# Altium schematic sheet SDEC944-xD_Chargeur_Batterie.SchDoc: Chargeur Batterie
size 393 x 270 mm; CompanyName: Seccom; Address1: 521, rue du capt. François Garbit; Address2: 69440 Mornant; Address3: seccom@seccom.fr; Address4: www.seccom.fr; DocumentNumber: 4; SheetNumber: 4; SheetTotal: 22; PageSetup: Record=PageOptions|CenterHorizontal=True|CenterVertical=True|PrintScale=0.72|XCorrection=1.00|YCorrection=1.00|PrintKind=0|BorderSize=5000000|LeftOffset=0|BottomOffset=0|Orientation=2|PaperLength=1000|PaperWidth=1000|Scale=100|PaperSource=7|PrintQuality=-4|MediaType=1|DitherType=10|PaperKind=A4|PrintScaleMode=1
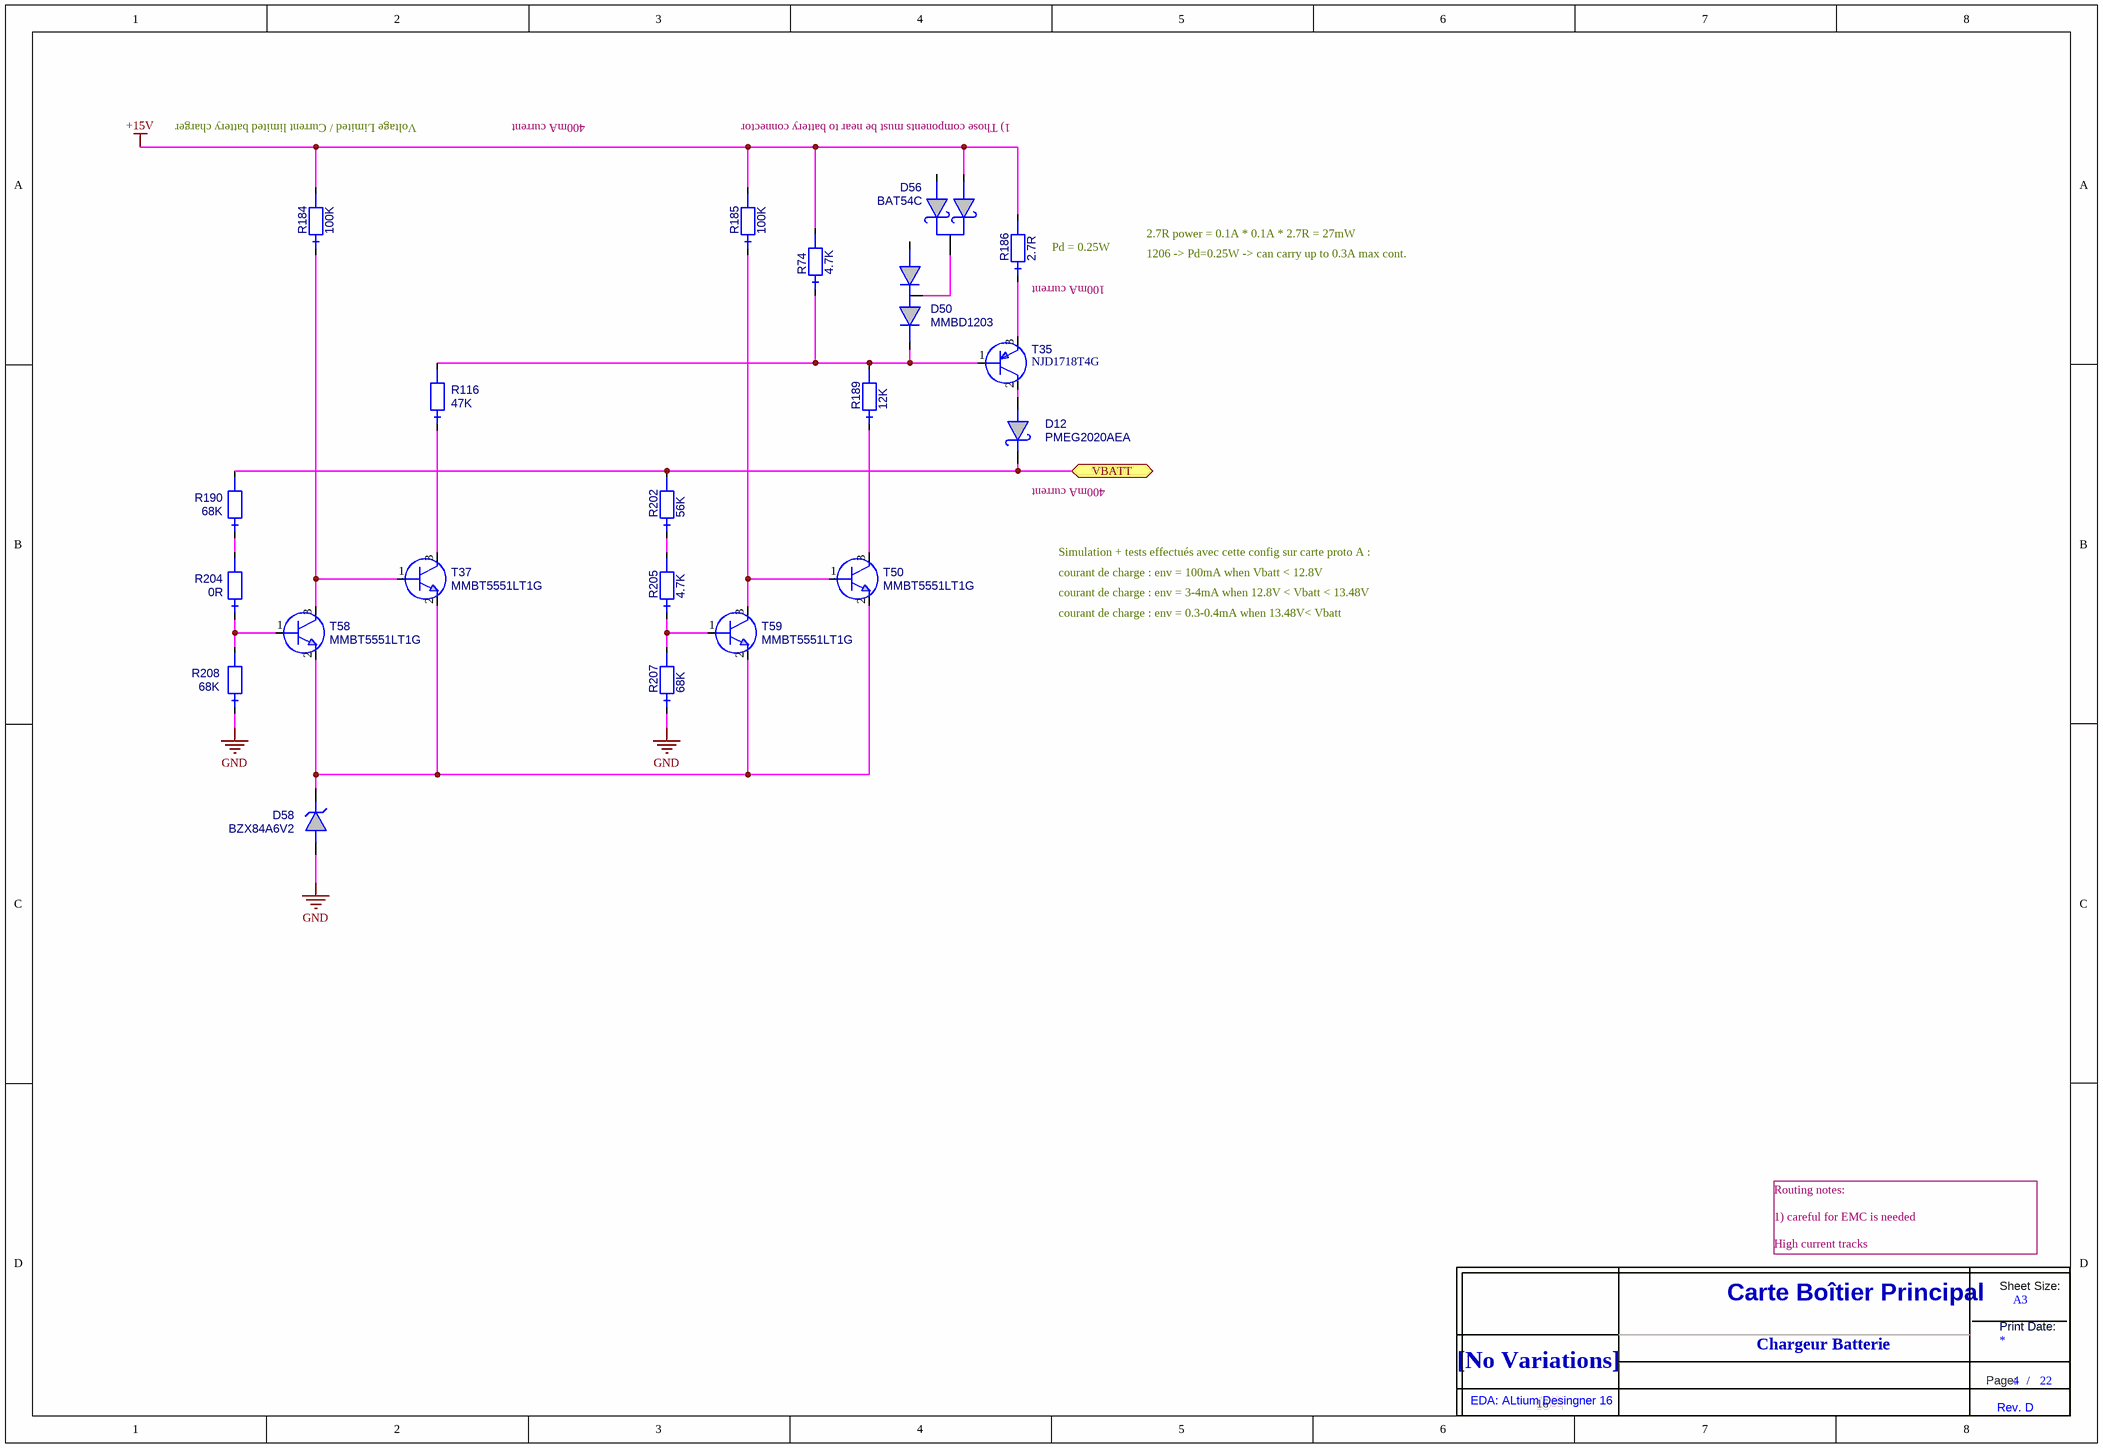
[diagram p0: SDEC944-xD_Chargeur_Batterie.SchDoc]

## Parts
D12  PMEG2020AEA  [SOD323_ReflowSoldering]
D50  MMBD1203  [SOT23_3L_ReflowSoldering]
D56  BAT54C  [SOT23_3L_ReflowSoldering]
D58  BZX84A6V2  [SOT23_3L_ReflowSoldering]
R74  value 4.7K  [0603_ReflowSoldering_RES]  (hidden comment: RES_0603_1%_100PPM_4.7K)
R116  value 47K  [0603_ReflowSoldering_RES]  (hidden comment: RES_0603_1%_100PPM_47K)
R184  value 100K  [0603_ReflowSoldering_RES]  (hidden comment: RES_0603_1%_100PPM_100K)
R185  value 100K  [0603_ReflowSoldering_RES]  (hidden comment: RES_0603_1%_100PPM_100K)
R186  value 2.7R  [1206_ReflowSoldering_RES]  (hidden comment: RES_1206_1%_100PPM_2.7R)
R189  value 12K  [0603_ReflowSoldering_RES]  (hidden comment: RES_0603_1%_100PPM_12K)
R190  value 68K  [0603_ReflowSoldering_RES]  (hidden comment: RES_0603_1%_100PPM_68K)
R202  value 56K  [0603_ReflowSoldering_RES]  (hidden comment: RES_0603_1%_100PPM_56K)
R204  value 0R  [0603_ReflowSoldering_RES]  (hidden comment: RES_0603_1%_100PPM_0R)
R205  value 4.7K  [0603_ReflowSoldering_RES]  (hidden comment: RES_0603_1%_100PPM_4.7K)
R207  value 68K  [0603_ReflowSoldering_RES]  (hidden comment: RES_0603_1%_100PPM_68K)
R208  value 68K  [0603_ReflowSoldering_RES]  (hidden comment: RES_0603_1%_100PPM_68K)
T35  NJD1718T4G  [DPAK_Specifique_1]
T37  MMBT5551LT1G  [SOT23_3L_ReflowSoldering]
T50  MMBT5551LT1G  [SOT23_3L_ReflowSoldering]
T58  MMBT5551LT1G  [SOT23_3L_ReflowSoldering]
T59  MMBT5551LT1G  [SOT23_3L_ReflowSoldering]
Title_new  DNI  (value not drawn)  (graphical)

## Ports
VBATT (bidir)

## Nets
+15V: D56.1 R74.2 R184.2 R185.2 R186.2
GND: D58.1 R207.1 R208.1
VBATT: D12.K R190.2 R202.2 ; port VBATT
NetD12_A: D12.A T35.2(C)
NetD50_2: D50.2 R74.1 R116.2 R189.2 T35.1(B)
NetD50_3: D50.3 D56.3
NetD58_3: D58.3 T37.2(E) T50.2(E) T58.2(E) T59.2(E)
NetR116_1: R116.1 T37.3(C)
NetR184_1: R184.1 T37.1(B) T58.3(C)
NetR185_1: R185.1 T50.1(B) T59.3(C)
NetR186_1: R186.1 T35.3(E)
NetR189_1: R189.1 T50.3(C)
NetR190_1: R190.1 R204.2
NetR202_1: R202.1 R205.2
NetR204_1: R204.1 R208.2 T58.1(B)
NetR205_1: R205.1 R207.2 T59.1(B)

Not connected (* = marked no-connect by the designer): D50 1; D56 2; D58 2

## Notes on the sheet
- Voltage Limited / Current limited battery charger
- 400mA current
- 1) Those components must be near to battery connector
- (near R186) Pd = 0.25W
- 2.7R power = 0.1A * 0.1A * 2.7R = 27mW
- 1206 -> Pd=0.25W -> can carry up to 0.3A max cont.
- (near R186) 100mA current
- (near D12) 400mA current
- courant de charge : env = 100mA when Vbatt < 12.8V
- courant de charge : env = 3-4mA when 12.8V < Vbatt < 13.48V
- Simulation + tests effectués avec cette config sur carte proto A :
- courant de charge : env = 0.3-0.4mA when 13.48V< Vbatt
- Routing notes:
  1) careful for EMC is needed
  High current tracks
- Chargeur Batterie
- 16
- (in symbol Title_new) Sheet Size:; Carte Boîtier Principal; A3; Print Date:; [No Variations]; Page:; /; EDA: ALtium Desingner 16; Rev. D

## Library data of the parts
D12 = PMEG2020AEA: Diode Schottky, Vrrm=20V, If=2A, Vf=0.45V, CMS; Creation: PDP (10/07/12); Boitier: SOD323; Remarque: {Remarque}; Coeff: 1; Fabricant: NXP; Verification: *; ComponentLink1URL: o:\_Documentation\Datasheets\NXP\PMEG2020AEA.PDF; ComponentLink2URL: o:\_Documentation\Datasheets\_BOITIERS\ACTIF_CMS\SOD\SOD_80_(MLL34)_(Schneider).PDF; Config: *; ComponentLink1Description: Datasheet; ComponentLink2Description: Datasheet Boitier; Ref Fab: PMEG2020AEA; Value: PMEG2020AEA
D50 = MMBD1203: Diode de Redressement double, en série, Vrrm=100V, If=200mA, Vf=1V, rapide (trr=4ns), CMS; Creation: LJ (28/04/11); Reference: 001730/00; Boitier: SOT23_3L; Remarque: {Remarque}; Coeff: 1; Fabricant: Fairchild; ComponentLink1URL: o:\_Documentation\Datasheets\Fairchild\MMBD1201-2-3-4-5.pdf; ComponentLink2URL: o:\_Documentation\Datasheets\_BOITIERS\ACTIF_CMS\SOT\SOT_23_3P_(Schneider).PDF; Config: *; ComponentLink1Description: Datasheet; ComponentLink2Description: Datasheet Boitier; Supplier 1: Farnell; Supplier 2: Mouser; Supplier Part Number 1: 1700901; Supplier Part Number 2: 512-MMBD1203; Ref Fab: MMBD1203; Value: MMBD1203
D56 = BAT54C: Diode Schottky double, BAT54 cathode com, Vrrm=30V, If=300mA, Vf=0.4Vmax, CMS; Creation: LJ (14/05/02); Reference: 000597/00; Boitier: SOT23_3L; Remarque: {Remarque}; Coeff: 1; Fabricant: NXP; Verification: LJ (14/05/02); ComponentLink1URL: O:\_Documentation\Datasheets\NXP\BAT54_series.pdf; ComponentLink2URL: o:\_Documentation\Datasheets\_BOITIERS\ACTIF_CMS\SOT\SOT_23_3P_(Schneider).PDF; Config: *; ComponentLink1Description: Datasheet; ComponentLink2Description: Datasheet Boitier; Ref Fab: BAT54C; Supplier 1: Farnell; Supplier Part Number 1: 1081192; Value: BAT54C
D58 = BZX84A6V2: Diode Zener, série BZX84A, 0.3W, +/-5%, 6.2V, CMS; Creation: PDP (19/09/12); Boitier: SOT23_3L; Remarque: {Remarque}; Coeff: 1; Fabricant: NXP; ComponentLink1URL: o:\_Documentation\Datasheets\NXP\BZX84_SERIES.pdf; ComponentLink2URL: o:\_Documentation\Datasheets\_BOITIERS\ACTIF_CMS\SOT\SOT_23_3P_(Schneider).PDF; Config: *; ComponentLink1Description: Datasheet; ComponentLink2Description: Datasheet Boitier; Ref Fab: BZX84A6V2; Supplier 1: Mouser; Supplier Part Number 1: 771-BZX84-A6V2,215; Value: BZX84A6V2
R74 R205 = RES_0603_1%_100PPM_4.7K: Résistance, 0.100W, 1%, 100ppm, 75V, 4.7K; Creation: JPL (05/07/12); Boitier: 0603; Remarque: {Remarque}; Fabricant: Vishay; Ref Fab: CRCW06034K70FKEA; Coeff: 1; Verification: *; ComponentLink1URL: O:\_Documentation\Datasheets\Vishay\Resistances_D-CRCWe3.pdf; ComponentLink2URL: o:\_Documentation\Datasheets\_BOITIERS\PASSIF_CMS\; Config: *; ComponentLink1Description: Datasheet; ComponentLink2Description: Datasheet Boitier; Supplier 1: Farnell; Supplier 2: RadioSpares; Supplier Part Number 1: 1469807; Supplier Part Number 2: 6790484
R116 = RES_0603_1%_100PPM_47K: Résistance, 0.100W, 1%, 100ppm, 75V, 47K; Creation: JPL (05/07/12); Boitier: 0603; Remarque: {Remarque}; Fabricant: Vishay; Ref Fab: CRCW060347K0FKEA; Coeff: 1; Verification: *; ComponentLink1URL: O:\_Documentation\Datasheets\Vishay\Resistances_D-CRCWe3.pdf; ComponentLink2URL: o:\_Documentation\Datasheets\_BOITIERS\PASSIF_CMS\; Config: *; ComponentLink1Description: Datasheet; ComponentLink2Description: Datasheet Boitier; Supplier 1: Farnell; Supplier 2: RadioSpares; Supplier Part Number 1: 1469811; Supplier Part Number 2: 6790425
R184 R185 = RES_0603_1%_100PPM_100K: Résistance, 0.100W, 1%, 100ppm, 75V, 100K; Creation: FB (02/10/12); Boitier: 0603; Remarque: {Remarque}; Fabricant: Vishay; Ref Fab: CRCW0603100KFKEA; Coeff: 1; Verification: *; ComponentLink1URL: O:\_Documentation\Datasheets\Vishay\Resistances_D-CRCWe3.pdf; ComponentLink2URL: o:\_Documentation\Datasheets\_BOITIERS\PASSIF_CMS\; Config: *; ComponentLink1Description: Datasheet; ComponentLink2Description: Datasheet Boitier; Supplier 1: Farnell; Supplier Part Number 1: 1469649; Supplier 2: Mouser; Supplier Part Number 2: 71-CRCW0603-100K-E3
R186 = RES_1206_1%_100PPM_2.7R: Résistance, 0.25W, 1%, 100ppm, 200V, 2.7R; Creation: FB (02/10/12); Boitier: 1206; Remarque: {Remarque}; Fabricant: Vishay; Ref Fab: CRCW12062R70FKEA; Coeff: 1; Verification: *; ComponentLink1URL: O:\_Documentation\Datasheets\Vishay\Resistances_D-CRCWe3.pdf; ComponentLink2URL: o:\_Documentation\Datasheets\_BOITIERS\PASSIF_CMS\; Config: *; ComponentLink1Description: Datasheet; ComponentLink2Description: Datasheet Boitier
R189 = RES_0603_1%_100PPM_12K: Résistance, 0.100W, 1%, 100ppm, 75V, 12K; Creation: PDP (19/09/12); Boitier: 0603; Remarque: {Remarque}; Fabricant: Vishay; Ref Fab: CRCW060312K0FKEA; Coeff: 1; ComponentLink1URL: O:\_Documentation\Datasheets\Vishay\Resistances_D-CRCWe3.pdf; ComponentLink2URL: o:\_Documentation\Datasheets\_BOITIERS\PASSIF_CMS\; Config: *; ComponentLink1Description: Datasheet; ComponentLink2Description: Datasheet Boitier; Supplier 1: Mouser; Supplier Part Number 1: 71-CRCW0603-12K-E3; Supplier 2: Farnell; Supplier Part Number 2: 1652834
R190 R207 R208 = RES_0603_1%_100PPM_68K: Résistance, 0.100W, 1%, 100ppm, 75V, 68K; Creation: PDP (19/09/12); Boitier: 0603; Remarque: {Remarque}; Fabricant: Vishay; Ref Fab: CRCW060368K0FKEA; Coeff: 1; Verification: *; ComponentLink1URL: O:\_Documentation\Datasheets\Vishay\Resistances_D-CRCWe3.pdf; ComponentLink2URL: o:\_Documentation\Datasheets\_BOITIERS\PASSIF_CMS\; Config: *; ComponentLink1Description: Datasheet; ComponentLink2Description: Datasheet Boitier; Supplier 1: Mouser; Supplier Part Number 1: 71-CRCW0603-68K-E3; Supplier 2: Farnell; Supplier Part Number 2: 1469832RL
R202 = RES_0603_1%_100PPM_56K: Résistance, 0.100W, 1%, 100ppm, 75V, 56K; Creation: PDP 19/09/2012; Boitier: 0603; Remarque: {Remarque}; Fabricant: Vishay; Ref Fab: CRCW060356K0FKEA; Coeff: 1; ComponentLink1URL: O:\_Documentation\Datasheets\Vishay\Resistances_D-CRCWe3.pdf; ComponentLink2URL: o:\_Documentation\Datasheets\_BOITIERS\PASSIF_CMS\; Config: *; ComponentLink1Description: Datasheet; ComponentLink2Description: Datasheet Boitier; Supplier 1: Farnell; Supplier Part Number 1: 1613127; Supplier 2: Mouser; Supplier Part Number 2: 71-CRCW0603-56K-E3
R204 = RES_0603_1%_100PPM_0R: Résistance, 0.100W, 1%, 100ppm, 75V, 0R; Creation: FB (04/07/12); Boitier: 0603; Remarque: {Remarque}; Fabricant: Vishay; Ref Fab: CRCW06030000Z0EA; Coeff: 1; Verification: *; ComponentLink1URL: O:\_Documentation\Datasheets\Vishay\Resistances_D-CRCWe3.pdf; ComponentLink2URL: o:\_Documentation\Datasheets\_BOITIERS\PASSIF_CMS\; Config: *; ComponentLink1Description: Datasheet; ComponentLink2Description: Datasheet Boitier; Supplier 1: Farnell; Supplier Part Number 1: 1469739
T35 = NJD1718T4G: Transistor PNP, Vce=50V, Ic=3A, 15W, hfe=40~240, -65/+150°C, CMS; Creation: PDP (19/09/12); Boitier: DPAK; Remarque: {Remarque}; Coeff: 1; Fabricant: ON Semiconductor; ComponentLink1URL: o:\_Documentation\Datasheets\ON_Semiconductors\NJD1718-D.PDF; Config: *; ComponentLink1Description: Datasheet; ComponentLink2Description: Datasheet Boitier; Supplier 1: Mouser; Supplier Part Number 1: 863-NJD1718T4G; Ref Fab: NJD1718T4G; Value: NJD1718T4G
T37 T50 T58 T59 = MMBT5551LT1G: Transistor NPN, Vce=160V, Ic=60mA, 0.225W, hfe=30~250, -55/+150°C, CMS; Creation: CHD; Reference: 000474/00; Boitier: SOT23_3L; Remarque: {Remarque}; Coeff: 1; Fabricant: ON Semiconductor; Verification: *; ComponentLink1URL: o:\_Documentation\Datasheets\ON_Semiconductors\MMBT5550LT1.pdf; ComponentLink2URL: O:\_Documentation\Datasheets\_BOITIERS\ACTIF_CMS\SOT & TSOT\SOT23_3_(Schneider).pdf; Config: *; ComponentLink1Description: Datasheet; Supplier 1: Farnell; Supplier 2: Mouser; Ref Fab: MMBT5551LT1G; Value: MMBT5551LT1G; Supplier Part Number 1: 1459109; Supplier Part Number 2: 863-MMBT5551LT1G; ComponentLink2Description: Datasheet Boitier
Title_new = Title_new